# EAGLE schematic ADDER (EAGLE 9.6.2)
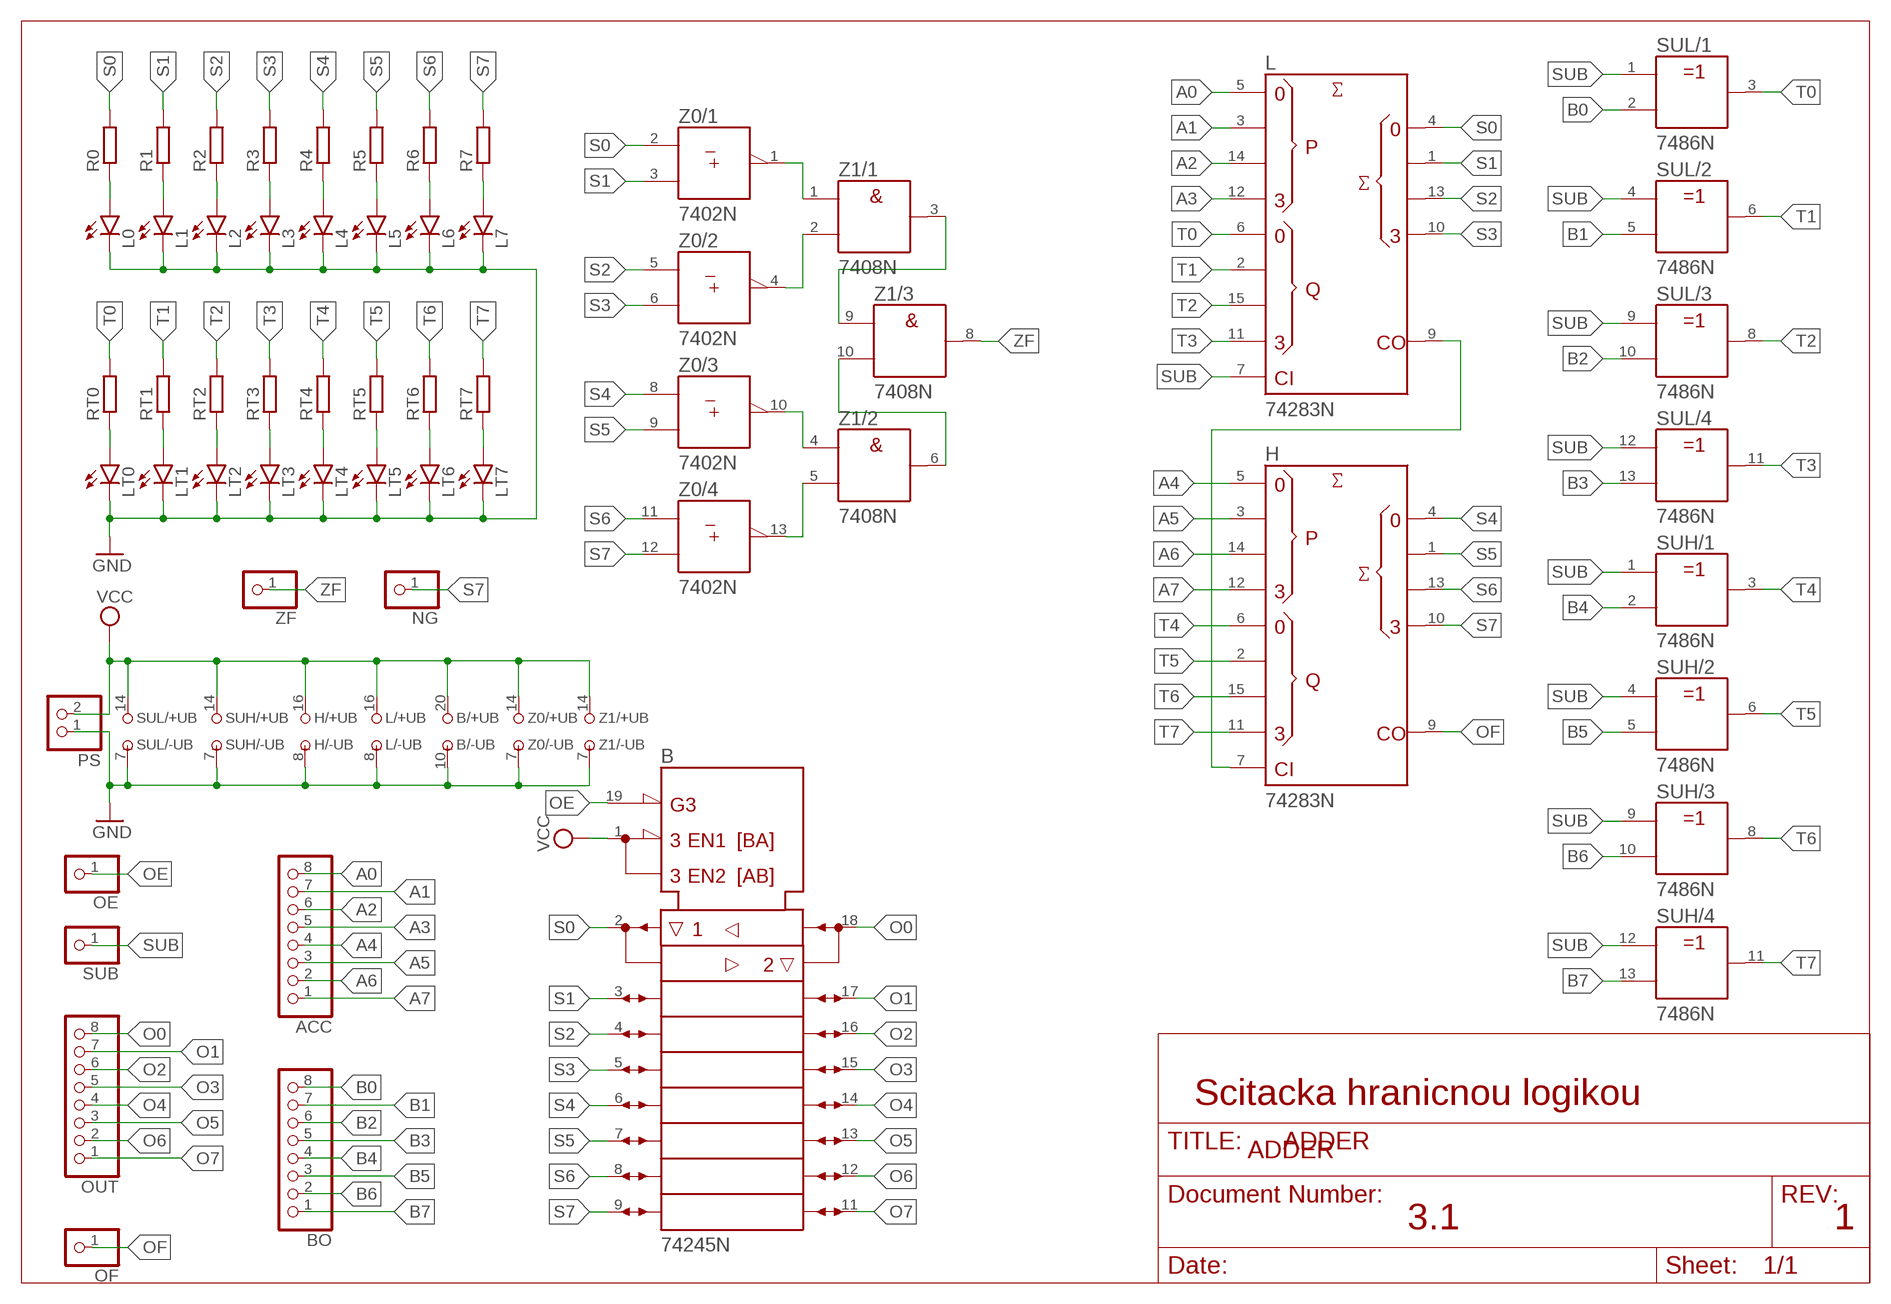
[diagram p0: schematic, sheet 1]

## Parts
ACC  PINHD-1X8  [1X08]
B  74245N  [DIL20]
BO  PINHD-1X8  [1X08]
H  74283N  [DIL16]
L  74283N  [DIL16]
L0  LED5MM  [LED5MM]
L1  LED5MM  [LED5MM]
L2  LED5MM  [LED5MM]
L3  LED5MM  [LED5MM]
L4  LED5MM  [LED5MM]
L5  LED5MM  [LED5MM]
L6  LED5MM  [LED5MM]
L7  LED5MM  [LED5MM]
LT0  LED5MM  [LED5MM]
LT1  LED5MM  [LED5MM]
LT2  LED5MM  [LED5MM]
LT3  LED5MM  [LED5MM]
LT4  LED5MM  [LED5MM]
LT5  LED5MM  [LED5MM]
LT6  LED5MM  [LED5MM]
LT7  LED5MM  [LED5MM]
NG  PINHD-1X1  [1X01]
OE  PINHD-1X1  [1X01]
OF  PINHD-1X1  [1X01]
OUT  PINHD-1X8  [1X08]
PS  PINHD-1X2  [1X02]
R0  R-EU_0204/7  [0204/7]
R1  R-EU_0204/7  [0204/7]
R2  R-EU_0204/7  [0204/7]
R3  R-EU_0204/7  [0204/7]
R4  R-EU_0204/7  [0204/7]
R5  R-EU_0204/7  [0204/7]
R6  R-EU_0204/7  [0204/7]
R7  R-EU_0204/7  [0204/7]
RT0  R-EU_0204/7  [0204/7]
RT1  R-EU_0204/7  [0204/7]
RT2  R-EU_0204/7  [0204/7]
RT3  R-EU_0204/7  [0204/7]
RT4  R-EU_0204/7  [0204/7]
RT5  R-EU_0204/7  [0204/7]
RT6  R-EU_0204/7  [0204/7]
RT7  R-EU_0204/7  [0204/7]
SUB  PINHD-1X1  [1X01]
SUH  7486N  [DIL14]
SUL  7486N  [DIL14]
Z0  7402N  [DIL14]
Z1  7408N  [DIL14]
ZF  PINHD-1X1  [1X01]

## Nets
A0: ACC.8 L.5(A1)
A1: ACC.7 L.3(A2)
A2: ACC.6 L.14(A3)
A3: ACC.5 L.12(A4)
A4: ACC.4 H.5(A1)
A5: ACC.3 H.3(A2)
A6: ACC.2 H.14(A3)
A7: ACC.1 H.12(A4)
B0: BO.8 SUL.2(/1:B)
B1: BO.7 SUL.5(/2:B)
B2: BO.6 SUL.10(/3:B)
B3: BO.5 SUL.13(/4:B)
B4: BO.4 SUH.2(/1:B)
B5: BO.3 SUH.5(/2:B)
B6: BO.2 SUH.10(/3:B)
B7: BO.1 SUH.13(/4:B)
GND: B.10(-UB) H.8(-UB) L0.K(C) L1.K(C) L2.K(C) L3.K(C) L4.K(C) L5.K(C) L6.K(C) L7.K(C) L.8(-UB) LT0.K(C) LT1.K(C) LT2.K(C) LT3.K(C) LT4.K(C) LT5.K(C) LT6.K(C) LT7.K(C) PS.1 SUH.7(/-UB:-UB) SUL.7(/-UB:-UB) Z0.7(/-UB:-UB) Z1.7(/-UB:-UB)
N$1: H.7(C0) L.9(C4)
N$2: L0.A R0.1
N$5: L1.A R1.1
N$7: L2.A R2.1
N$9: L3.A R3.1
N$11: L4.A R4.1
N$13: L5.A R5.1
N$15: L6.A R6.1
N$17: L7.A R7.1
N$18: Z0.13(/4:Y) Z1.5(/2:B)
N$19: LT0.A RT0.1
N$20: Z0.10(/3:Y) Z1.4(/2:A)
N$21: LT1.A RT1.1
N$22: Z1.6(/2:Y) Z1.10(/3:B)
N$23: LT2.A RT2.1
N$25: LT3.A RT3.1
N$26: Z1.3(/1:Y) Z1.9(/3:A)
N$27: LT4.A RT4.1
N$28: Z0.4(/2:Y) Z1.2(/1:B)
N$29: LT5.A RT5.1
N$30: Z0.1(/1:Y) Z1.1(/1:A)
N$31: LT6.A RT6.1
N$33: LT7.A RT7.1
O0: B.18(B1) OUT.8
O1: B.17(B2) OUT.7
O2: B.16(B3) OUT.6
O3: B.15(B4) OUT.5
O4: B.14(B5) OUT.4
O5: B.13(B6) OUT.3
O6: B.12(B7) OUT.2
O7: B.11(B8) OUT.1
OE: B.19(!G) OE.1
OF: H.9(C4) OF.1
S0: B.2(A1) L.4(S1) R0.2 Z0.2(/1:A)
S1: B.3(A2) L.1(S2) R1.2 Z0.3(/1:B)
S2: B.4(A3) L.13(S3) R2.2 Z0.5(/2:A)
S3: B.5(A4) L.10(S4) R3.2 Z0.6(/2:B)
S4: B.6(A5) H.4(S1) R4.2 Z0.8(/3:A)
S5: B.7(A6) H.1(S2) R5.2 Z0.9(/3:B)
S6: B.8(A7) H.13(S3) R6.2 Z0.11(/4:A)
S7: B.9(A8) H.10(S4) NG.1 R7.2 Z0.12(/4:B)
SUB: L.7(C0) SUB.1 SUH.1(/1:A) SUH.4(/2:A) SUH.9(/3:A) SUH.12(/4:A) SUL.1(/1:A) SUL.4(/2:A) SUL.9(/3:A) SUL.12(/4:A)
T0: L.6(B1) RT0.2 SUL.3(/1:Y)
T1: L.2(B2) RT1.2 SUL.6(/2:Y)
T2: L.15(B3) RT2.2 SUL.8(/3:Y)
T3: L.11(B4) RT3.2 SUL.11(/4:Y)
T4: H.6(B1) RT4.2 SUH.3(/1:Y)
T5: H.2(B2) RT5.2 SUH.6(/2:Y)
T6: H.15(B3) RT6.2 SUH.8(/3:Y)
T7: H.11(B4) RT7.2 SUH.11(/4:Y)
VCC: B.1(DIR) B.20(+UB) H.16(+UB) L.16(+UB) PS.2 SUH.14(/+UB:+UB) SUL.14(/+UB:+UB) Z0.14(/+UB:+UB) Z1.14(/+UB:+UB)
ZF: Z1.8(/3:Y) ZF.1
Unconnected: Z1.11(/4:Y) Z1.12(/4:A) Z1.13(/4:B)

## Notes on the sheet
- Scitacka hranicnou logikou
- ADDER
- 3.1 | 1

## Library data of the parts
ACC BO OUT = pinhead:PINHD-1X8: PIN HEADER
B = 74ttl-din:74*245: Octal BUS TRANSCEIVER, 3-state
H L = 74ttl-din:74*283: 4-bit binary FULL ADDER, fast carry
L0 L1-L7 LT0 LT1-LT7 = led:LED: LED OSRAM: - CHIPLED LG R971, LG N971, LY N971, LG Q971, LY Q971, LO R971, LY R971 LH N974, LH R974 LS Q976, LO Q976, LY Q976 LO Q996 - Hyper CHIPLED LW Q18S LB Q993, LB Q99A, LB R99A - SideLED LS A670, LO A670, LY A670, LG A670, LP A670 LB A673, LV A673, LT A673, LW A673 LH A674 LY A675 LS A676, LA A676, LO A676, LY A676, LW A676 LS A679, LY A679, LG A679 - Hyper Micro SIDELED® LS Y876, LA Y876, LO Y876, LY Y876 LT Y87S - SmartLED LW L88C, LW L88S LB L89C, LB L89S, LG L890 LS L89K, LO L89K, LY L89K LS L896, LA L896, LO L896, LY L896 - TOPLED LS T670, LO T670, LY T670, LG T670, LP T670 LSG T670, LSP T670, LSY T670, LOP T670, LYG T670 LG T671, LOG T671, LSG T671 LB T673, LV T673, LT T673, LW T673 LH T674 LS T676, LA T676, LO T676, LY T676, LB T676, LH T676, LSB T676, LW T676 LB T67C, LV T67C, LT T67C, LS T67K, LO T67K, LY T67K, LW E67C LS E67B, LA E67B, LO E67B, LY E67B, LB E67C, LV E67C, LT E67C LW T67C LS T679, LY T679, LG T679 LS T770, LO T770, LY T770, LG T770, LP T770 LB T773, LV T773, LT T773, LW T773 LH T774 LS E675, LA E675, LY E675, LS T675 LS T776, LA T776, LO T776, LY T776, LB T776 LHGB T686 LT T68C, LB T68C - Hyper Mini TOPLED® LB M676 - Mini TOPLED Santana® LG M470 LS M47K, LO M47K, LY M47K Source: http://www.osram.convergy.de LUXEON: - LUMILED® LXK2-PW12-R00, LXK2-PW12-S00, LXK2-PW14-U00, LXK2-PW14-V00 LXK2-PM12-R00, LXK2-PM12-S00, LXK2-PM14-U00 LXK2-PE12-Q00, LXK2-PE12-R00, LXK2-PE12-S00, LXK2-PE14-T00, LXK2-PE14-U00 LXK2-PB12-K00, LXK2-PB12-L00, LXK2-PB12-M00, LXK2-PB14-N00, LXK2-PB14-P00, LXK2-PB14-Q00 LXK2-PR12-L00, LXK2-PR12-M00, LXK2-PR14-Q00, LXK2-PR14-R00 LXK2-PD12-Q00, LXK2-PD12-R00, LXK2-PD12-S00 LXK2-PH12-R00, LXK2-PH12-S00 LXK2-PL12-P00, LXK2-PL12-Q00, LXK2-PL12-R00 Source: www.luxeon.com KINGBRIGHT: KA-3528ASYC Source: www.kingbright.com
NG OE OF SUB ZF = pinhead:PINHD-1X1: PIN HEADER
PS = pinhead:PINHD-1X2: PIN HEADER
R0 R1-R7 RT0 RT1-RT7 = rcl:R-EU_: RESISTOR, European symbol; SPICEPREFIX: R
SUH SUL = 74ttl-din:74*86: Quad 2-input EXCLUSIV-OR gate
Z0 = 74ttl-din:74*02: Quad 2-input NOR gate
Z1 = 74ttl-din:74*08: Quad 2-input AND gate